# Altium project connection_board.PrjPcb
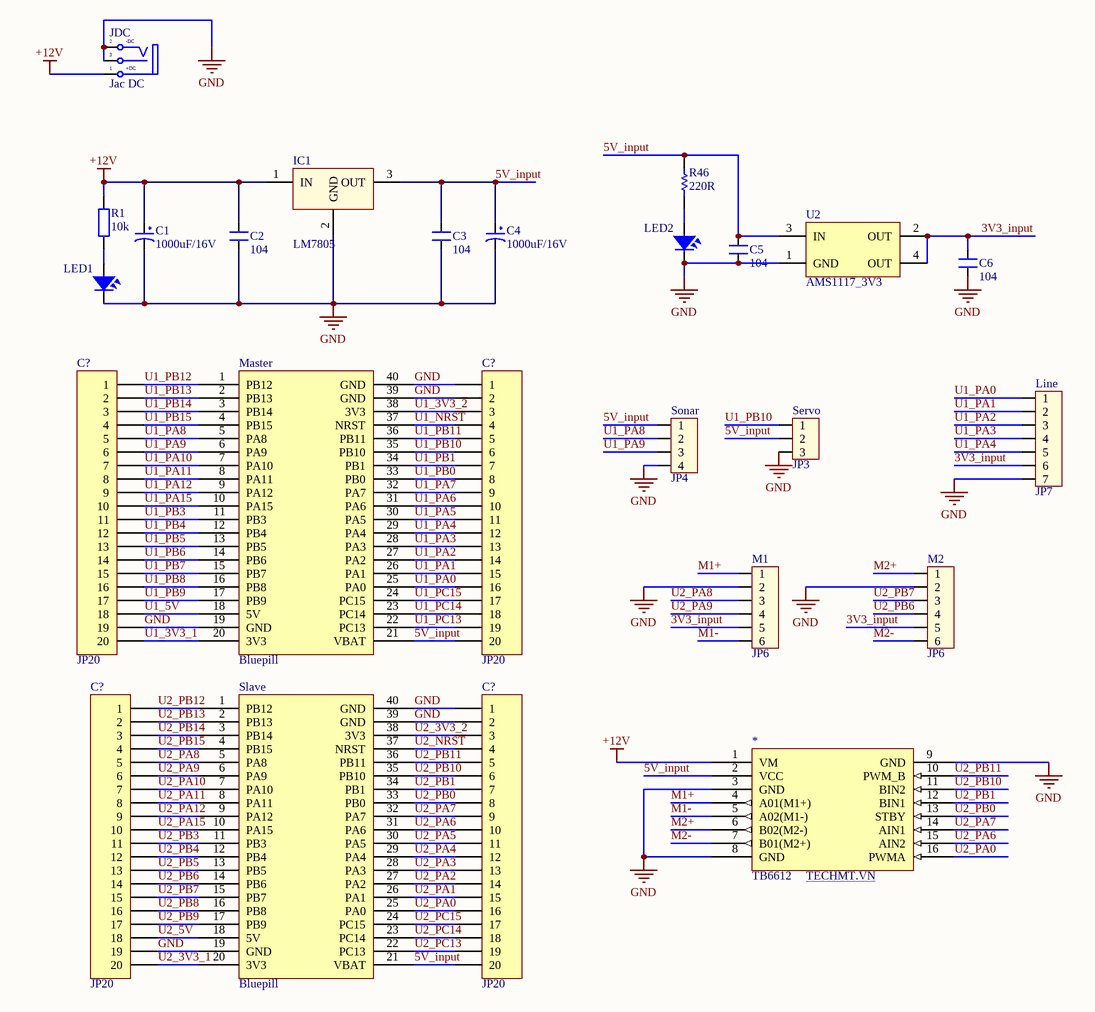
[diagram p0: connection_board.SchDoc]
1 sheet, 25 parts. Net scope: global (net labels, ports and power ports of the same name join across sheets).
Board file: connection_board.PcbDoc

## Sheet connection_board.SchDoc
size A3; SheetNumber: 1; SheetTotal: 1

### Parts
(Parts that share a designator on the sheet are numbered #1, #2 ... from top to bottom, then left to right.)
*  TB6612  WEB: TECHMT.VN  [TB6612]
C1  1000uF/16V  [CP1.5/3.4]
C2  104  [CN2]
C3  104  [CN2]
C4  1000uF/16V  [CP1.5/3.4]
C5  104  [CN2]
C6  104  [CN2]
C?#1  JP20  [JP20-C1T]
C?#2  JP20  [JP20-C1T]
C?#3  JP20  [JP20-C1T]
C?#4  JP20  [JP20-C1T]
IC1  LM7805  [QTO-220]
JDC  Jac DC  [DC-IN]
LED1  LED  [LED-3]  (value not drawn)
LED2  LED  [LED-3]  (value not drawn)
Line  JP7  [CON7]
M1  JP6  [CON6]
M2  JP6  [CON6]
Master  Bluepill  [Blue Pill]
R1  10k  [R1/4W]
R46  value 220R  [R1/4W]  (hidden comment: Res1)
Servo  JP3  [CON3]
Slave  Bluepill  [Blue Pill]
Sonar  JP4  [CON4]
U2  AMS1117_3V3  [SOT223-4M]

### Nets
+12V: *.1(VM) C1.1 C2.2 IC1.1(IN) JDC.1(T) R1.2
GND: *.3(GND) *.8(GND) *.9(GND) C1.2 C2.1 C3.1 C4.2 C5.1 C6.1 C?#1.19 C?#2.1 C?#2.2 C?#3.19 C?#4.1 C?#4.2 IC1.2(GND) JDC.2(TN) JDC.3(S) LED1.2 LED2.2 Line.7 M1.2 M2.2 Master.19(GND) Master.39(GND) Master.40(GND) Servo.3 Slave.19(GND) Slave.39(GND) Slave.40(GND) Sonar.4 U2.1(GND)
3V3_input: C6.2 Line.6 M1.5 M2.5 U2.2(OUT) U2.4(OUT)
5V_input: *.2(VCC) C3.2 C4.1 C5.2 C?#2.20 C?#4.20 IC1.3(OUT) Master.21(VBAT) R46.2 Servo.2 Slave.21(VBAT) Sonar.1 U2.3(IN)
M1+: *.4(A01(M1+)) M1.1
M1-: *.5(A02(M1-)) M1.6
M2+: *.6(B02(M2-)) M2.1
M2-: *.7(B01(M2+)) M2.6
U1_3V3_1: C?#1.20 Master.20(3V3)
U1_3V3_2: C?#2.3 Master.38(3V3)
U1_5V: C?#1.18 Master.18(5V)
U1_NRST: C?#2.4 Master.37(NRST)
U1_PA0: C?#2.16 Line.1 Master.25(PA0)
U1_PA1: C?#2.15 Line.2 Master.26(PA1)
U1_PA2: C?#2.14 Line.3 Master.27(PA2)
U1_PA3: C?#2.13 Line.4 Master.28(PA3)
U1_PA4: C?#2.12 Line.5 Master.29(PA4)
U1_PA5: C?#2.11 Master.30(PA5)
U1_PA6: C?#2.10 Master.31(PA6)
U1_PA7: C?#2.9 Master.32(PA7)
U1_PA8: C?#1.5 Master.5(PA8) Sonar.2
U1_PA9: C?#1.6 Master.6(PA9) Sonar.3
U1_PA10: C?#1.7 Master.7(PA10)
U1_PA11: C?#1.8 Master.8(PA11)
U1_PA12: C?#1.9 Master.9(PA12)
U1_PA15: C?#1.10 Master.10(PA15)
U1_PB0: C?#2.8 Master.33(PB0)
U1_PB1: C?#2.7 Master.34(PB1)
U1_PB3: C?#1.11 Master.11(PB3)
U1_PB4: C?#1.12 Master.12(PB4)
U1_PB5: C?#1.13 Master.13(PB5)
U1_PB6: C?#1.14 Master.14(PB6)
U1_PB7: C?#1.15 Master.15(PB7)
U1_PB8: C?#1.16 Master.16(PB8)
U1_PB9: C?#1.17 Master.17(PB9)
U1_PB10: C?#2.6 Master.35(PB10) Servo.1
U1_PB11: C?#2.5 Master.36(PB11)
U1_PB12: C?#1.1 Master.1(PB12)
U1_PB13: C?#1.2 Master.2(PB13)
U1_PB14: C?#1.3 Master.3(PB14)
U1_PB15: C?#1.4 Master.4(PB15)
U1_PC13: C?#2.19 Master.22(PC13)
U1_PC14: C?#2.18 Master.23(PC14)
U1_PC15: C?#2.17 Master.24(PC15)
U2_3V3_1: C?#3.20 Slave.20(3V3)
U2_3V3_2: C?#4.3 Slave.38(3V3)
U2_5V: C?#3.18 Slave.18(5V)
U2_NRST: C?#4.4 Slave.37(NRST)
U2_PA0: *.16(PWMA) C?#4.16 Slave.25(PA0)
U2_PA1: C?#4.15 Slave.26(PA1)
U2_PA2: C?#4.14 Slave.27(PA2)
U2_PA3: C?#4.13 Slave.28(PA3)
U2_PA4: C?#4.12 Slave.29(PA4)
U2_PA5: C?#4.11 Slave.30(PA5)
U2_PA6: *.15(AIN2) C?#4.10 Slave.31(PA6)
U2_PA7: *.14(AIN1) C?#4.9 Slave.32(PA7)
U2_PA8: C?#3.5 M1.3 Slave.5(PA8)
U2_PA9: C?#3.6 M1.4 Slave.6(PA9)
U2_PA10: C?#3.7 Slave.7(PA10)
U2_PA11: C?#3.8 Slave.8(PA11)
U2_PA12: C?#3.9 Slave.9(PA12)
U2_PA15: C?#3.10 Slave.10(PA15)
U2_PB0: *.13(STBY) C?#4.8 Slave.33(PB0)
U2_PB1: *.12(BIN1) C?#4.7 Slave.34(PB1)
U2_PB3: C?#3.11 Slave.11(PB3)
U2_PB4: C?#3.12 Slave.12(PB4)
U2_PB5: C?#3.13 Slave.13(PB5)
U2_PB6: C?#3.14 M2.4 Slave.14(PB6)
U2_PB7: C?#3.15 M2.3 Slave.15(PB7)
U2_PB8: C?#3.16 Slave.16(PB8)
U2_PB9: C?#3.17 Slave.17(PB9)
U2_PB10: *.11(BIN2) C?#4.6 Slave.35(PB10)
U2_PB11: *.10(PWM_B) C?#4.5 Slave.36(PB11)
U2_PB12: C?#3.1 Slave.1(PB12)
U2_PB13: C?#3.2 Slave.2(PB13)
U2_PB14: C?#3.3 Slave.3(PB14)
U2_PB15: C?#3.4 Slave.4(PB15)
U2_PC13: C?#4.19 Slave.22(PC13)
U2_PC14: C?#4.18 Slave.23(PC14)
U2_PC15: C?#4.17 Slave.24(PC15)
NetLED1_1: LED1.1 R1.1
NetLED2_1: LED2.1 R46.1

### Notes on the sheet
- (in symbol DCIN) -DC; +DC

### Library data of the parts
C1 C4 = CP3: Cap 100uF/35V - 470uF/16V; Value: 100uF/35V/50V; Description 1: 1000uF/6,3V - 470uF/16V - 330uF - 25V; Description 2: 220uF/35V - 100uF/50V - 63V - 4,7uF/200V; Description 3: 22uF => 33uF100V - 3,3uF => 4,7uF/250V; Description 4: 2,2uF =>3,3uF/350 - 2,2uF/400V - 1uF/450V
C2 C3 C5 C6 = CN2: Cap np 104 => 105pF; Value: 0.1uF
C?#1-C?#4 = JP20: WR-PHD 2.54 mm Angled Socket Header; Manufacturer: W¨¹rth Elektronik eiSos GmbH; partNo: 613020143121; ComponentLink1 Description: Manufacturer; ComponentLink2 Description: Datasheet; NoPins: 20; Created Date: 29 March 2013; ComponentLink1URL: http://www.we-online.com; ComponentLink2URL: http://katalog.we-online.de/em/datasheet/6130xx143121.pdf; Created by: Karrer Zheng
IC1 = LM78xx: On ap +, from + 5 to + 24VDC; Value: LM7805
JDC = DCIN: Jac DC input; Value: Jac DC
LED1 LED2 = LED: LED Single colour Green and Red; Value: LED 3 ly Single Colour
Line = Con7: Connector 7; Value: Connector 7
M1 M2 = Con6: Connector 6; Value: Connector 6
Master Slave = STM32F103C8T6
R1 = R1/4W: Resistor 1/4W; Value: R1/4W - 1K
R46 = Res1_4: Resistor; Manufacturer: Generic Components; Class: Passive; Published: 08/06/2000; Publisher: Altium Hobart Technology Centre; SubClass: Resistor
Servo = Con3: Connector 3; Value: Connector 3
Sonar = Con4: Connector 4; Value: Connector 4
U2 = AMS1117_3V3: 1A Regulator